# Altium schematic sheet change.SchDoc
size A4
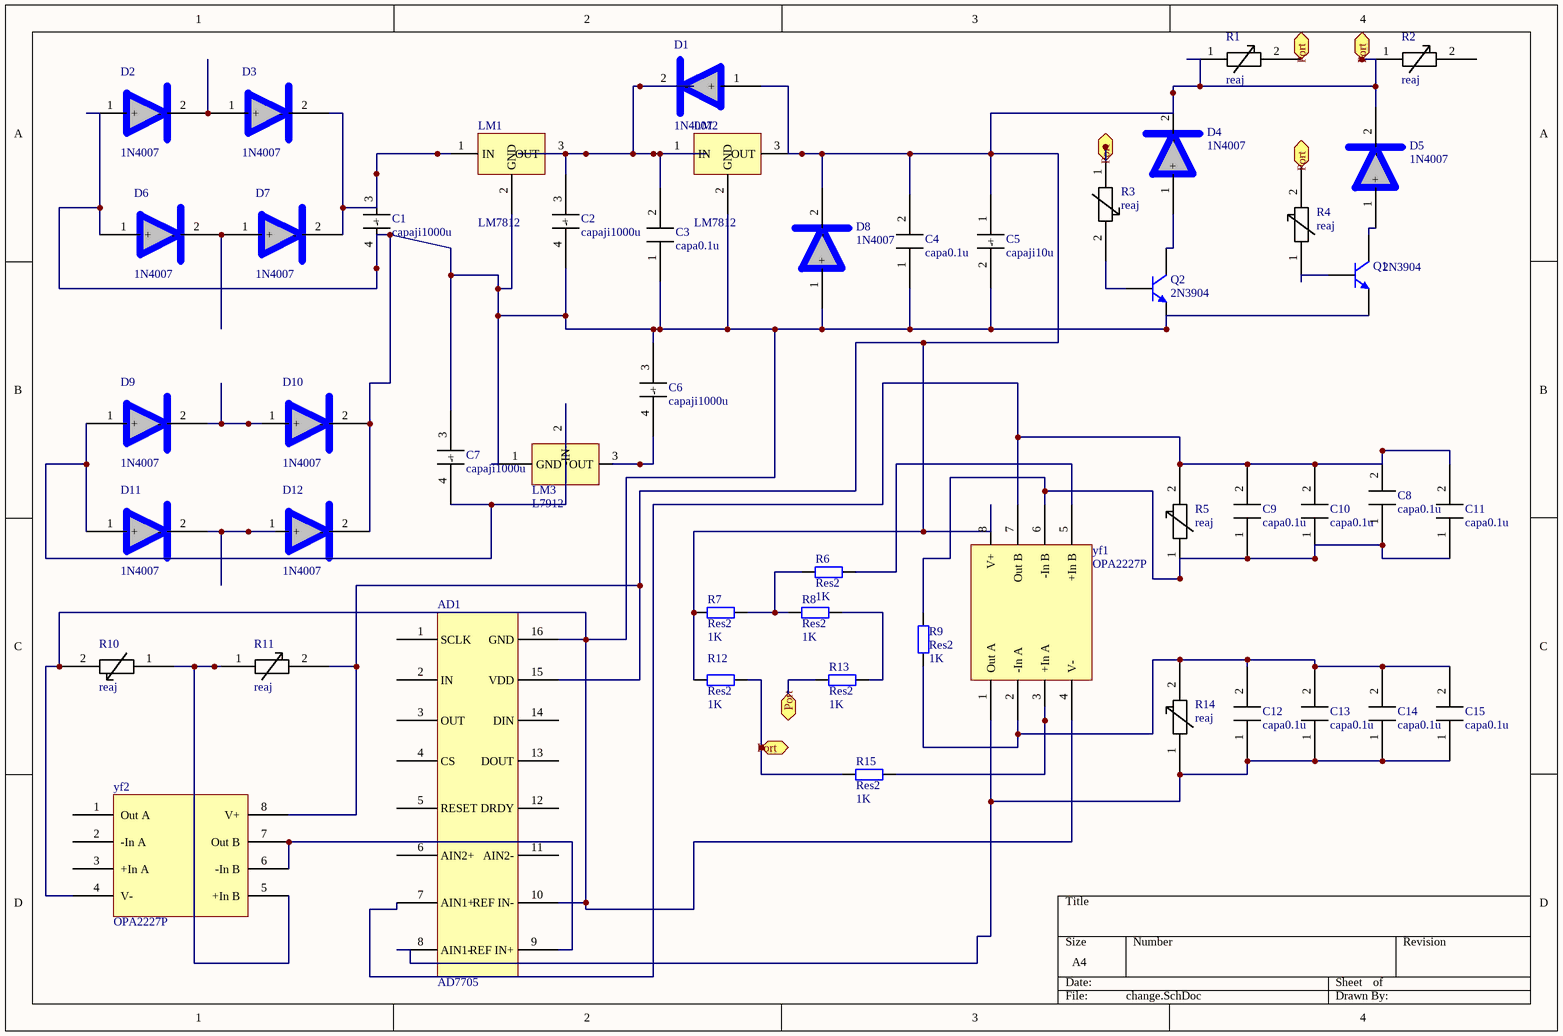
[diagram p0: change.SchDoc]

## Parts
AD1  AD7705  [xinpian16]
C1  capaji1000u  [capaji1000]
C2  capaji1000u  [capaji1000]
C3  capa0.1u  [capa0.1]
C4  capa0.1u  [capa0.1]
C5  capaji10u  [capaji10u]
C6  capaji1000u  [capaji1000]
C7  capaji1000u  [capaji1000]
C8  capa0.1u  [capa0.1]
C9  capa0.1u  [capa0.1]
C10  capa0.1u  [capa0.1]
C11  capa0.1u  [capa0.1]
C12  capa0.1u  [capa0.1]
C13  capa0.1u  [capa0.1]
C14  capa0.1u  [capa0.1]
C15  capa0.1u  [capa0.1]
D1  1N4007  [1N4007]
D2  1N4007  [1N4007]
D3  1N4007  [1N4007]
D4  1N4007  [1N4007]
D5  1N4007  [1N4007]
D6  1N4007  [1N4007]
D7  1N4007  [1N4007]
D8  1N4007  [1N4007]
D9  1N4007  [1N4007]
D10  1N4007  [1N4007]
D11  1N4007  [1N4007]
D12  1N4007  [1N4007]
LM1  LM7812  [LM7812]
LM2  LM7812  [LM7812]
LM3  L7912  [LM7812]
Q1  2N3904  [TO-92A]
Q2  2N3904  [TO-92A]
R1  reaj  [reaj]
R2  reaj  [reaj]
R3  reaj  [reaj]
R4  reaj  [reaj]
R5  reaj  [reaj]
R6  Res2  value 1K  [AXIAL-0.4]
R7  Res2  value 1K  [AXIAL-0.4]
R8  Res2  value 1K  [AXIAL-0.4]
R9  Res2  value 1K  [AXIAL-0.4]
R10  reaj  [reaj]
R11  reaj  [reaj]
R12  Res2  value 1K  [AXIAL-0.4]
R13  Res2  value 1K  [AXIAL-0.4]
R14  reaj  [reaj]
R15  Res2  value 1K  [AXIAL-0.4]
yf1  OPA2227P  [yunfang8]
yf2  OPA2227P  [yunfang8]

## Ports
Port

## Nets
Port: AD1.15(VDD) C4.2 C5.1(+) D1.1(+) D4.2(-) D5.2(-) D8.2(-) LM2.3(OUT) R1.1 R1.2 R2.1 R3.1 R4.2 R7.1 R11.2 R12.1 R12.2 R13.1 R15.1 yf1.8(V+) yf2.8(V+) ; port Port
NetAD1_7: AD1.7(AIN1+) C8.2 C9.2 C10.2 C11.2 R5.2 yf1.7(Out_B)
NetAD1_8: AD1.8(AIN1-) C12.1 C13.1 C14.1 C15.1 R14.1 yf1.1(Out_A)
NetAD1_9: AD1.9(REF_IN+) yf2.6(-In_B) yf2.7(Out_B)
NetAD1_10: AD1.10(REF_IN-) AD1.16(GND) C1.4(-) C2.4(-) C3.1 C4.1 C5.2(-) C6.3(+) C7.3(+) D2.1(+) D6.1(+) D8.1(+) D10.2(-) D12.2(-) LM1.2(GND) LM2.2(GND) LM3.1(GND) Q1.1(E) Q2.1(E) R10.2 yf1.4(V-) yf2.4(V-)
NetC1_3: C1.3(+) D3.2(-) D7.2(-) LM1.1(IN)
NetC2_3: C2.3(+) C3.2 D1.2(-) LM1.3(OUT) LM2.1(IN)
NetC6_4: C6.4(-) LM3.3(OUT)
NetC7_4: C7.4(-) D9.1(+) D11.1(+) LM3.2(-IN)
NetC8_1: C8.1 C9.1 C10.1 C11.1 R5.1 R9.1 yf1.6(-In_B)
NetC12_2: C12.2 C13.2 C14.2 C15.2 R9.2 R14.2 yf1.2(-In_A)
NetD2_2: D2.2(-) D3.1(+)
NetD4_1: D4.1(+) Q2.3(C)
NetD5_1: D5.1(+) Q1.3(C)
NetD6_2: D6.2(-) D7.1(+)
NetD9_2: D9.2(-) D10.1(+)
NetD11_2: D11.2(-) D12.1(+)
NetQ1_2: Q1.2(B) R4.1
NetQ2_2: Q2.2(B) R3.2
NetR6_1: R6.1 R7.2 R8.1
NetR6_2: R6.2 yf1.5(+In_B)
NetR8_2: R8.2 R13.2
NetR10_1: R10.1 R11.1 yf2.5(+In_B)
NetR15_2: R15.2 yf1.3(+In_A)

Not connected (* = marked no-connect by the designer): AD1 1(SCLK) 2(IN) 3(OUT) 4(CS) 5(RESET) 6(AIN2+) 11(AIN2-) 12(DRDY) 13(DOUT) 14(DIN); R2 2; yf2 1(Out_A) 2(-In_A) 3(+In_A)

## Library data of the parts
C5 = capaji10u: 10u
Q1 Q2 = 2N3904: NPN General Purpose Amplifier; Published: 8-Jun-2000; LatestRevisionDate: 15-Jan-2003; LatestRevisionNote: PCB Footprint 'BCY-W3/D4.7' replaced; DatasheetVersion: 1997; PackageVersion: Sep-1998; PackageReference: TO-92A; Publisher: Altium Limited; PackageDescription: TO, Flat Index; 3 In-Line, Axial Leads; Body Dia. 4.5mm; Leads 0.51 x 0.48 mm (max); ComponentLink1Description: Manufacturer Link; ComponentLink1URL: http://www.fairchildsemi.com/; ComponentLink2Description: Datasheet; ComponentLink2URL: http://www.fairchildsemi.com/ds/2N%2F2N3904.pdf
R6-R9 R12 R13 R15 = Res2: Resistor; Published: 8-Jun-2000; LatestRevisionDate: 17-Jul-2002; LatestRevisionNote: Re-released for DXP Platform.; PackageReference: AXIAL-0.4; Publisher: Altium Limited; PackageDescription: Axial Device, Thru-Hole; 2 Leads; 0.4 in Pin Spacing